# EAGLE schematic Console (EAGLE 7.7.0)
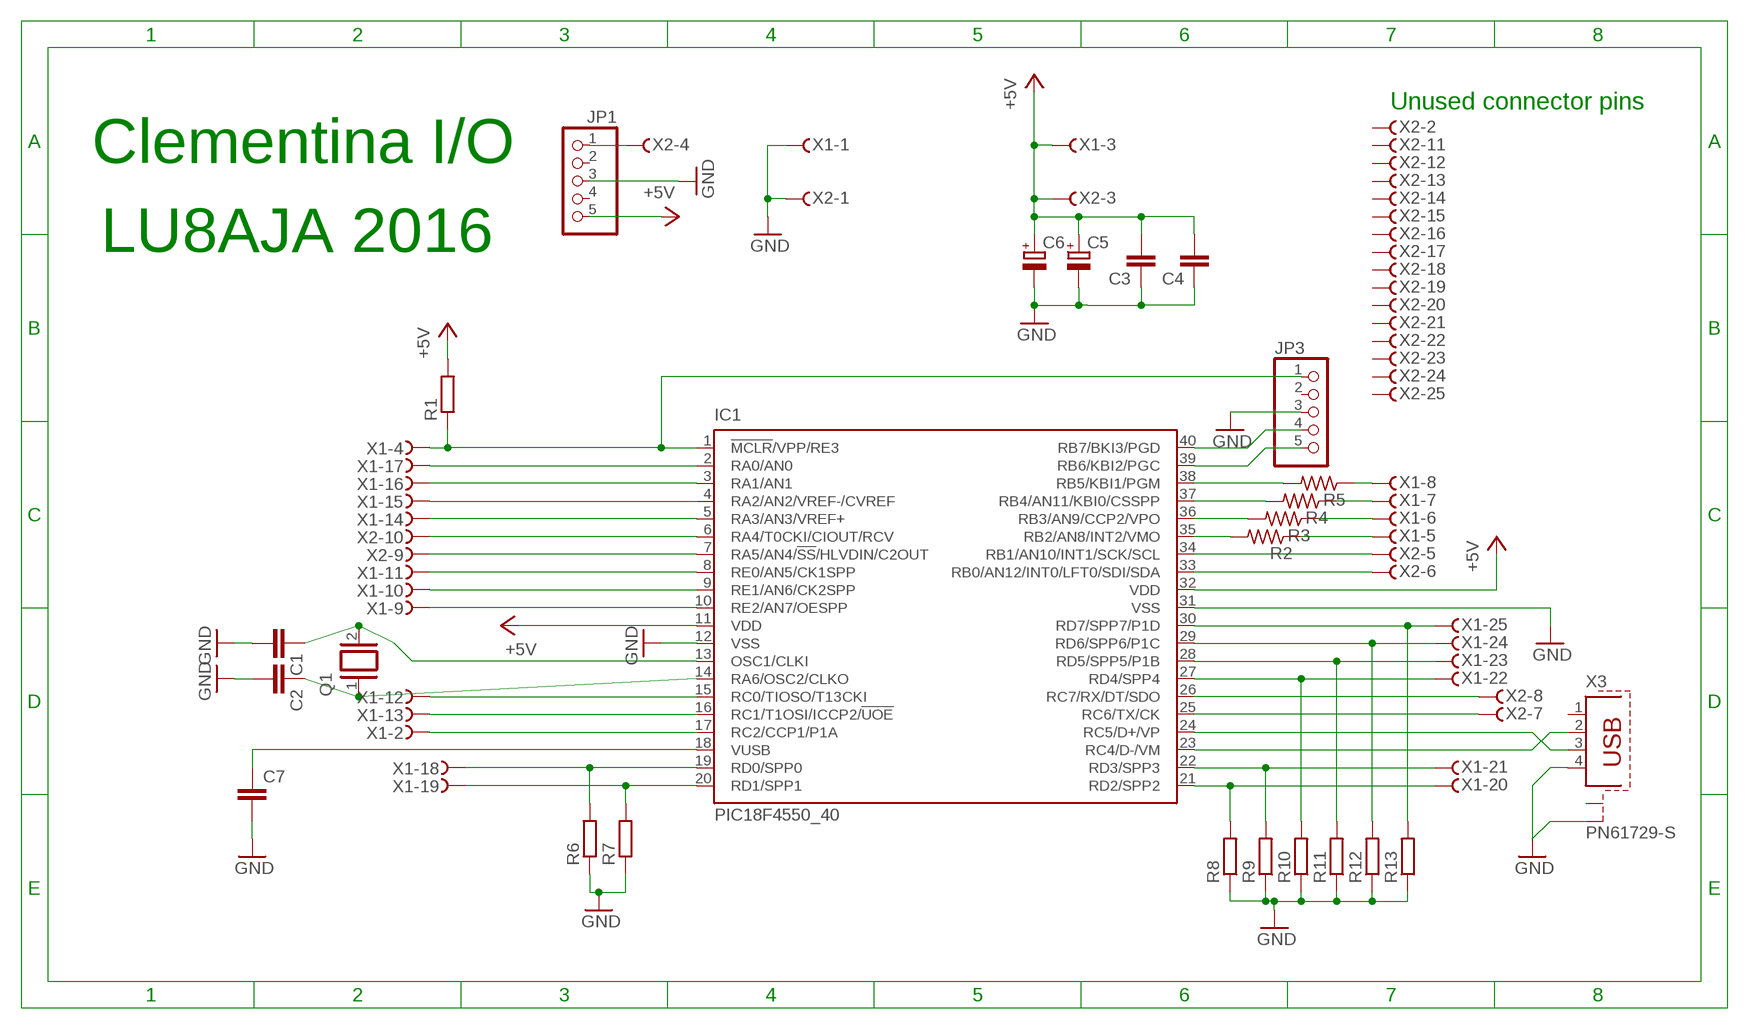
[diagram p0: schematic, sheet 1]

## Parts
C1  C-EU025-025X050  [C025-025X050]
C2  C-EU025-025X050  [C025-025X050]
C3  C-EU050-025X075  [C050-025X075]
C4  C-EU050-030X075  [C050-030X075]
C5  CPOL-EUE5-8.5  [E5-8,5]
C6  CPOL-EUE5-8.5  [E5-8,5]
C7  C-EU050-025X075  [C050-025X075]
IC1  PIC18F4550_40  [DIL40]
JP1  PINHD-1X5  [1X05]
JP3  PINHD-1X5  [1X05]
Q1  XTAL/S  [QS]
R1  R-EU_0207/15  [0207/15]
R2  R-US_0207/15  [0207/15]
R3  R-US_0207/15  [0207/15]
R4  R-US_0207/15  [0207/15]
R5  R-US_0207/15  [0207/15]
R6  R-EU_0207/15  [0207/15]
R7  R-EU_0207/15  [0207/15]
R8  R-EU_0207/15  [0207/15]
R9  R-EU_0207/15  [0207/15]
R10  R-EU_0207/15  [0207/15]
R11  R-EU_0207/15  [0207/15]
R12  R-EU_0207/15  [0207/15]
R13  R-EU_0207/15  [0207/15]
X1  F25HPS  [F25HP]
X2  F25HPS  [F25HP]
X3  PN61729-S  [PN61729-S]

## Nets
+5V: C3.2 C4.2 C5.+ C6.+ IC1.11(VDD) IC1.32(VDD) JP1.5 R1.2 X1.3(-3:F) X2.3(-3:F)
GND: C1.2 C2.2 C3.1 C4.1 C5.- C6.- C7.2 IC1.12(VSS) IC1.31(VSS) JP1.3 JP3.3 R6.1 R7.1 R8.1 R9.1 R10.1 R11.1 R12.1 R13.1 X1.1(-1:F) X2.1(-1:F) X3.4 X3.S2
N$1: IC1.19(RD0/SPP0) R6.2 X1.18(-18:F)
N$2: C2.1 IC1.14(RA6/OSC2/CLKO) Q1.1
N$3: IC1.1(!MCLR!/VPP/RE3) JP3.1 R1.1 X1.4(-4:F)
N$4: IC1.8(RE0/AN5/CK1SPP) X1.11(-11:F)
N$5: IC1.9(RE1/AN6/CK2SPP) X1.10(-10:F)
N$6: IC1.10(RE2/AN7/OESPP) X1.9(-9:F)
N$7: IC1.2(RA0/AN0) X1.17(-17:F)
N$8: IC1.3(RA1/AN1) X1.16(-16:F)
N$9: IC1.4(RA2/AN2/VREF-/CVREF) X1.15(-15:F)
N$10: IC1.5(RA3/AN3/VREF+) X1.14(-14:F)
N$11: IC1.15(RC0/TIOSO/T13CKI) X1.12(-12:F)
N$12: C1.1 IC1.13(OSC1/CLKI) Q1.2
N$13: IC1.16(RC1/T1OSI/ICCP2/!UOE) X1.13(-13:F)
N$14: IC1.17(RC2/CCP1/P1A) X1.2(-2:F)
N$15: C7.1 IC1.18(VUSB)
N$16: IC1.20(RD1/SPP1) R7.2 X1.19(-19:F)
N$17: IC1.21(RD2/SPP2) R8.2 X1.20(-20:F)
N$18: IC1.22(RD3/SPP3) R9.2 X1.21(-21:F)
N$19: IC1.27(RD4/SPP4) R10.2 X1.22(-22:F)
N$20: IC1.28(RD5/SPP5/P1B) R11.2 X1.23(-23:F)
N$21: IC1.29(RD6/SPP6/P1C) R12.2 X1.24(-24:F)
N$22: IC1.30(RD7/SPP7/P1D) R13.2 X1.25(-25:F)
N$23: IC1.35(RB2/AN8/INT2/VMO) R2.2
N$24: IC1.36(RB3/AN9/CCP2/VPO) R3.2
N$25: IC1.37(RB4/AN11/KBI0/CSSPP) R4.2
N$26: IC1.38(RB5/KBI1/PGM) R5.2
N$27: IC1.24(RC5/D+/VP) X3.3
N$28: IC1.6(RA4/T0CKI/CIOUT/RCV) X2.10(-10:F)
N$29: IC1.7(RA5/AN4/!SS!/HLVDIN/C2OUT) X2.9(-9:F)
N$30: IC1.34(RB1/AN10/INT1/SCK/SCL) X2.5(-5:F)
N$31: IC1.33(RB0/AN12/INT0/LFT0/SDI/SDA) X2.6(-6:F)
N$32: IC1.26(RC7/RX/DT/SDO) X2.8(-8:F)
N$33: IC1.25(RC6/TX/CK) X2.7(-7:F)
N$34: IC1.23(RC4/D-/VM) X3.2
N$35: JP1.1 X2.4(-4:F)
N$36: R5.1 X1.8(-8:F)
N$37: R4.1 X1.7(-7:F)
N$38: R3.1 X1.6(-6:F)
N$39: R2.1 X1.5(-5:F)
N$53: IC1.39(RB6/KBI2/PGC) JP3.5
N$54: IC1.40(RB7/BKI3/PGD) JP3.4
Unconnected: JP1.2 JP1.4 JP3.2 X1.G1(-G:G1) X1.G2(-G:G2) X2.2(-2:F) X2.11(-11:F) X2.12(-12:F) X2.13(-13:F) X2.14(-14:F) X2.15(-15:F) X2.16(-16:F) X2.17(-17:F) X2.18(-18:F) X2.19(-19:F) X2.20(-20:F) X2.21(-21:F) X2.22(-22:F) X2.23(-23:F) X2.24(-24:F) X2.25(-25:F) X2.G1(-G:G1) X2.G2(-G:G2) X3.1 X3.S1

## Notes on the sheet
- Unused connector pins
- Clementina I/O
- LU8AJA 2016

## Library data of the parts
C1-C3 C7 = rcl:C-EU: CAPACITOR, European symbol
C4 = resistor:C-EU: CAPACITOR, European symbol
C5 C6 = rcl:CPOL-EU: POLARIZED CAPACITOR, European symbol
IC1 = microchip:PIC18F4*_40: USB Microcontrollers with nanoWatt Technology High-Performance, Enhanced Flash, 28/40/44-Pin, Source: http://ww1.microchip.com/downloads/en/devicedoc/39632c.pdf; MF: MICROCHIP; MPN: PIC18F4550-I/P; OC_FARNELL: 9321357; OC_NEWARK: 74K8623
JP1 JP3 = pinhead:PINHD-1X5: PIN HEADER
Q1 = special:XTAL/S: CRYSTAL
R1 R6-R13 = rcl:R-EU_: RESISTOR, European symbol
R2-R5 = rcl:R-US_: RESISTOR, American symbol
X1 X2 = con-subd:F25HPS: SUB-D; OC_FARNELL: unknown; OC_NEWARK: unknown
X3 = con-berg:PN61729-S: BERG USB connector; OC_FARNELL: unknown; OC_NEWARK: unknown